# EAGLE design TinyCube02b_vias_everywhere (EAGLE 7.5.0)
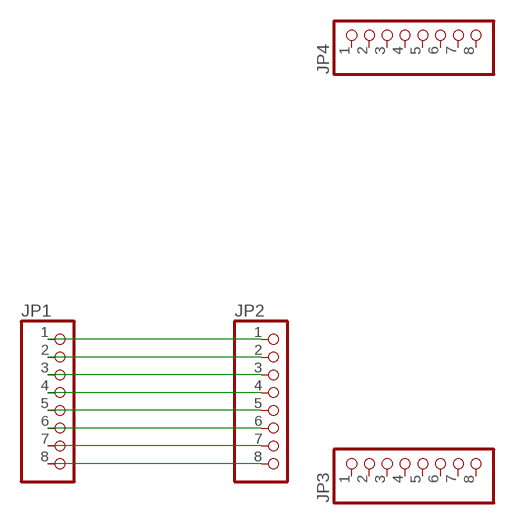
[diagram p0: schematic, sheet 1]

## Parts
JP1  PINHD-1X8BIG  [1X08-BIG]
JP2  PINHD-1X8BIG  [1X08-BIG]
JP3  PINHD-1X8BIG  [1X08-BIG]
JP4  PINHD-1X8BIG  [1X08-BIG]

## Nets
N$1: JP1.2 JP2.2
N$4: JP1.5 JP2.5
N$5: JP1.1 JP2.1
N$6: JP1.3 JP2.3
N$7: JP1.4 JP2.4
N$8: JP1.6 JP2.6
N$9: JP1.7 JP2.7
N$10: JP1.8 JP2.8
Unconnected: JP3.1 JP3.2 JP3.3 JP3.4 JP3.5 JP3.6 JP3.7 JP3.8 JP4.1 JP4.2 JP4.3 JP4.4 JP4.5 JP4.6 JP4.7 JP4.8

## Library data of the parts
JP1-JP4 = adafruit:PINHD-1X8: PIN HEADER

## Board
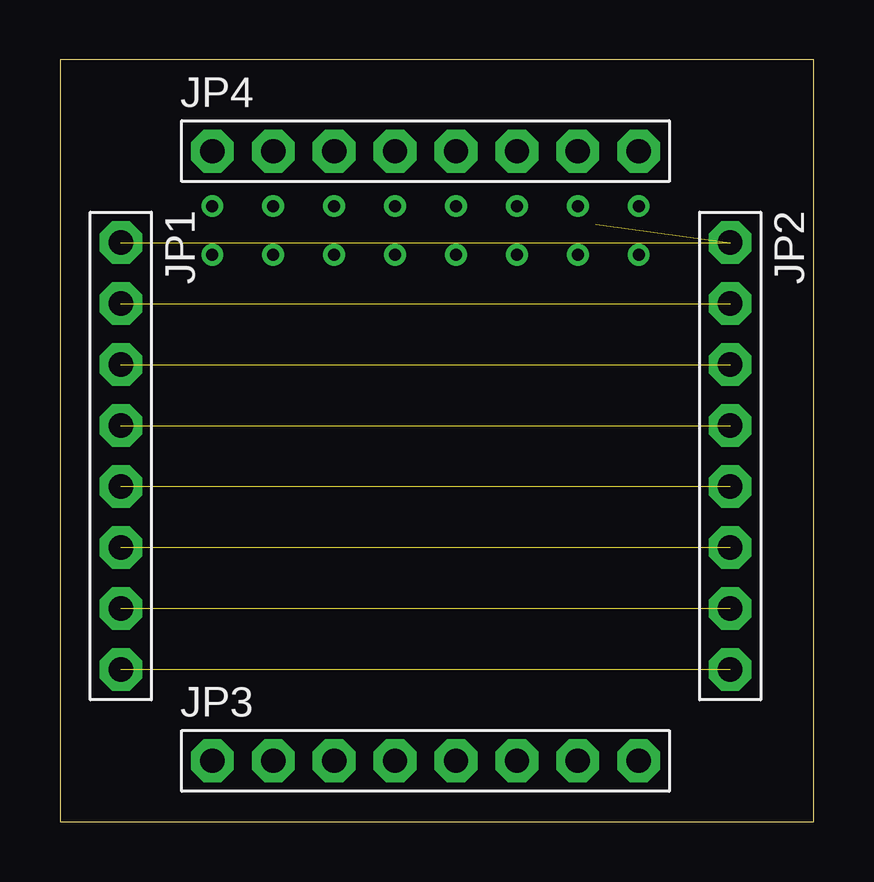
[diagram p1: board, top side]
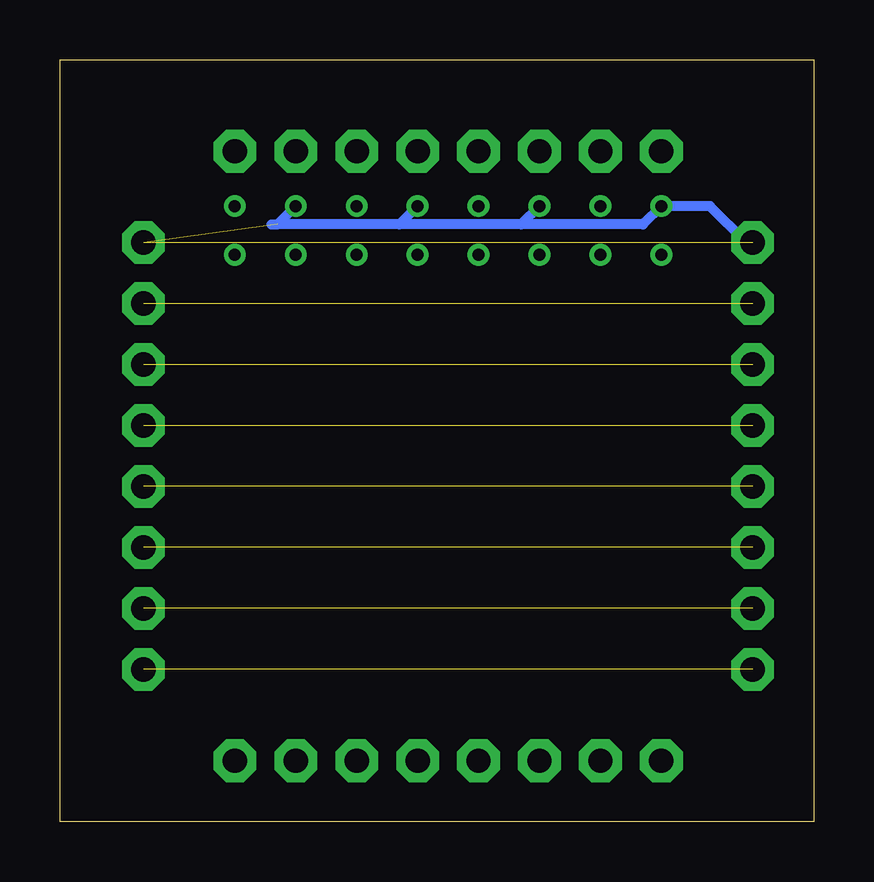
[diagram p2: board, bottom side, seen from below]

Size 31.42 x 31.74 mm. Coordinates in mm from the lower left corner, seen from the top.
Outline: 0,0 31.42,0 31.42,31.74 0,31.74 0,0
Copper layers (1*16): Top 0.035mm / dielectric 1.5mm / Bottom 0.035mm
Design rules "default": minimum track width 10mil, minimum drill 24mil, track to track 8mil, track to pad 8mil, pad to pad 8mil, via to via 8mil, smd to smd 8mil, copper to edge 40mil, drill to drill 8mil, minimum pad ring 10mil, minimum via ring 8mil, stop-mask expansion 4mil, vias tented up to drill 0mil, thermal gap 10mil

### Footprints (pad centres in the part's own frame; a part is rotated, then mirrored left to right if it is on the bottom)
1X08-BIG = drill 1.016 pad 1.778 octagon: 1 -8.89,0; 2 -6.35,0; 3 -3.81,0; 4 -1.27,0; 5 1.27,0; 6 3.81,0; 7 6.35,0; 8 8.89,0

### Placement (x,y rotation side)
JP1  2.54,15.24 270 top
JP2  27.94,15.24 270 top
JP3  15.24,2.54 0 top
JP4  15.24,27.94 0 top

### Tracks (layer width: path | path; a pad name or v marks a point on that pad's centre or on a via)
N$1  (1 unrouted)
N$2  (via drill 0.5 pad 0.25)
  other vias: 6.35,23.62
N$3  (via drill 0.5 pad 0.25)
  other vias: 8.89,23.62
N$4  (1 unrouted)
N$5  (2 unrouted)
  Bottom 0.406: JP1.1 2.79,24.13 4.32,25.65 6.35,25.65 7.11,24.89 12.19,24.89 | 11.43,25.65 12.19,24.89 | 12.19,24.89 17.27,24.89 | 16.51,25.65 17.27,24.89 | 17.27,24.89 22.35,24.89 | 22.61,24.89 22.35,24.89 | 21.59,25.65 22.35,24.89
N$6  (1 unrouted)
N$7  (1 unrouted)
N$8  (1 unrouted)
N$9  (1 unrouted)
N$10  (1 unrouted)
N$11  (via drill 0.5 pad 0.25)
  other vias: 11.43,25.65
N$12  (via drill 0.5 pad 0.25)
  other vias: 13.97,25.65
N$13  (via drill 0.5 pad 0.25)
  other vias: 6.35,25.65
N$14  (via drill 0.5 pad 0.25)
  other vias: 8.89,25.65
N$15  (via drill 0.5 pad 0.25)
  other vias: 11.43,23.62
N$16  (via drill 0.5 pad 0.25)
  other vias: 13.97,23.62
N$17  (via drill 0.5 pad 0.25)
  other vias: 16.51,25.65
N$18  (via drill 0.5 pad 0.25)
  other vias: 19.05,25.65
N$19  (via drill 0.5 pad 0.25)
  other vias: 16.51,23.62
N$20  (via drill 0.5 pad 0.25)
  other vias: 19.05,23.62
N$21  (via drill 0.5 pad 0.25)
  other vias: 21.59,25.65
N$22  (via drill 0.5 pad 0.25)
  other vias: 24.13,25.65
N$23  (via drill 0.5 pad 0.25)
  other vias: 21.59,23.62
N$24  (via drill 0.5 pad 0.25)
  other vias: 24.13,23.62